# Altium schematic sheet Sheet3.SchDoc
size A
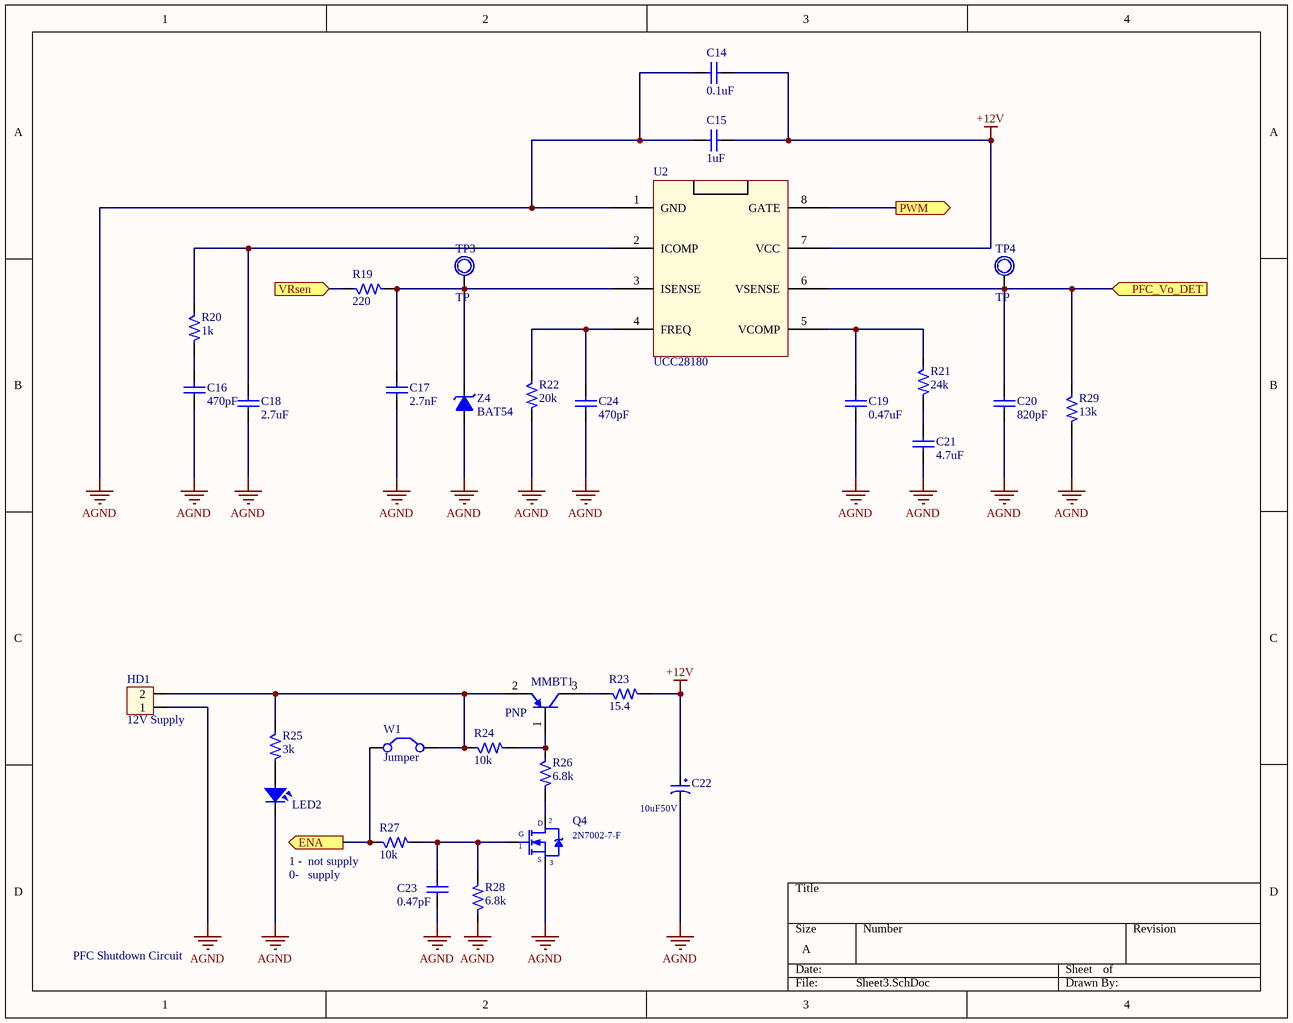
[diagram p0: Sheet3.SchDoc]

## Parts
C14  0.1uF  [SM-CAP-0805]
C15  1uF  [Cap 3228]
C16  470pF  [SM-CAP-0805]
C17  2.7nF  [SM-CAP-0805]
C18  2.7uF  [SM-CAP-0805]
C19  0.47uF  [SM-CAP-0805]
C20  820pF  [SM-CAP-0805]
C21  4.7uF  [SM-CAP-0805]
C22  10uF50V  [CAP-ALU-SMD-4.5x5x1.4]
C23  0.47pF  [SM-CAP-0805]
C24  470pF  [SM-CAP-0805]
HD1  12V Supply  [HED2]
LED2  LED  [SM-LED-0805-Green]  (value not drawn)
MMBT1  PNP  [SOT_23_P_transistor]
Q4  2N7002-7-F  [SOT_23_Mosfet]
R19  220  [SM-RES-0805]
R20  1k  [SM-RES-0805]
R21  24k  [SM-RES-0805]
R22  20k  [SM-RES-0805]
R23  15.4  [SM-RES-1206]
R24  10k  [SM-RES-0805]
R25  3k  [SM-RES-0805]
R26  6.8k  [SM-RES-0805]
R27  10k  [SM-RES-0805]
R28  6.8k  [SM-RES-0805]
R29  13k  [SM-RES-1206]
TP3  TP  [TP1]
TP4  TP  [TP1]
U2  UCC28180  [UCC28180]
W1  Jumper  [JP2]
Z4  BAT54  [BZT52C15]

## Ports
ENA (out), PFC_Vo_DET (in), PWM (out), VRsen (in)

## Nets
+12V: C14.1 C15.1 C22.1 R23.2 U2.7(VCC)
AGND: C14.2 C15.2 C16.1 C17.1 C18.1 C19.1 C20.1 C21.1 C22.2 C23.1 C24.1 HD1.1 LED2.2 Q4.1(G) R22.2 R28.1 R29.2 U2.1(GND) Z4.1(A)
ENA: R27.1 W1.1(C1) ; port ENA
PFC_Vo_DET: C20.2 R29.1 TP4.1 U2.6(VSENSE) ; port PFC_Vo_DET
PWM: U2.8(GATE) ; port PWM
VRsen: R19.1 ; port VRsen
NetC16_2: C16.2 R20.2
NetC17_2: C17.2 R19.2 TP3.1 U2.3(ISENSE) Z4.2(K)
NetC18_2: C18.2 R20.1 U2.2(ICOMP)
NetC19_2: C19.2 R21.1 U2.5(VCOMP)
NetC21_2: C21.2 R21.2
NetC23_2: C23.2 Q4.2(D) R27.2 R28.2
NetC24_2: C24.2 R22.1 U2.4(FREQ)
NetHD1_2: HD1.2 MMBT1.2(E) R24.1 R25.1 W1.2(C2)
NetLED2_1: LED2.1 R25.2
NetMMBT1_1: MMBT1.1(B) R24.2 R26.1
NetMMBT1_3: MMBT1.3(C) R23.1
NetQ4_3: Q4.3(S) R26.2

## Notes on the sheet
- (near R27) 1 -  not supply
- (near R27) 0-   supply
- PFC Shutdown Circuit

## Library data of the parts
C14-C21 C23 C24 = Cap Semi_3: Capacitor (Semiconductor SIM Model); Value: 104; LatestRevisionDate: 17-Jul-2002; LatestRevisionNote: Re-released for DXP Platform.; PackageReference: C1206; Publisher: Altium Limited
C22 = CP9: Cap 10000uF/63V; Value: 220uF/450V
HD1 = Hed2: Header 2 (Green); Value: Header 2
LED2 = LED: LED Single colour Green and Red; Value: LED 3 ly Single Colour
MMBT1 = PNP: PNP Bipolar Transistor; Published: 8-Jun-2000; LatestRevisionDate: 29-May-2009; LatestRevisionNote: IPC-7351 Footprint Added.; PackageVersion: Aug-1999; PackageReference: SOT-23B; Publisher: Altium Limited; PackageDescription: 3-Pin SOT-23 Package 0.95 mm Pitch, 2.4 mm Lead Span
Q4 = IRF840: MOSFET N - CHANNEL 500V - 0.75 - 8A - TO-220; Value: IRF840
R19-R29 = R: Resistor 1/4W; Value: R1/4W - 1K
TP3 TP4 = TP1: Test Point; Value: Test Point
W1 = Jumper: Jumper Wire; Published: 24-Mar-1999; LatestRevisionDate: 17-Jul-2002; LatestRevisionNote: Re-released for DXP Platform.; PackageReference: RAD-0.2; Publisher: Altium Limited; PackageDescription: Radial Cap, Thru-Hole; 2 Leads; 0.2 in Pin Spacing
Z4 = Zener